# Altium schematic sheet TOP.SchDoc
size A4
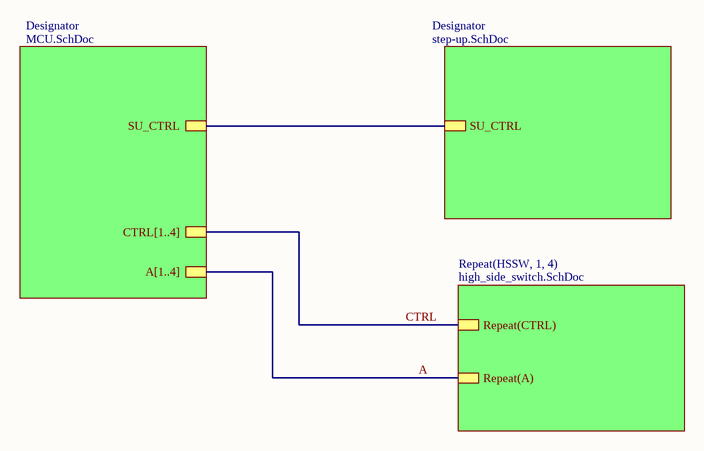
[diagram p0: TOP.SchDoc]

## Sub-sheets
Designator = MCU.SchDoc: A[1..4], CTRL[1..4], SU_CTRL
Designator = step-up.SchDoc: SU_CTRL
Repeat(HSSW, 1, 4) = high_side_switch.SchDoc: Repeat(CTRL), Repeat(A)

## Nets
A: sheet Repeat(HSSW, 1, 4)/Repeat(A)
CTRL: sheet Repeat(HSSW, 1, 4)/Repeat(CTRL)
(unnamed): sheet Designator/SU_CTRL, sheet Designator/SU_CTRL